# EAGLE schematic MCAT-CANYVAL-TOP-55X (EAGLE 7.2.0)
REV: 000
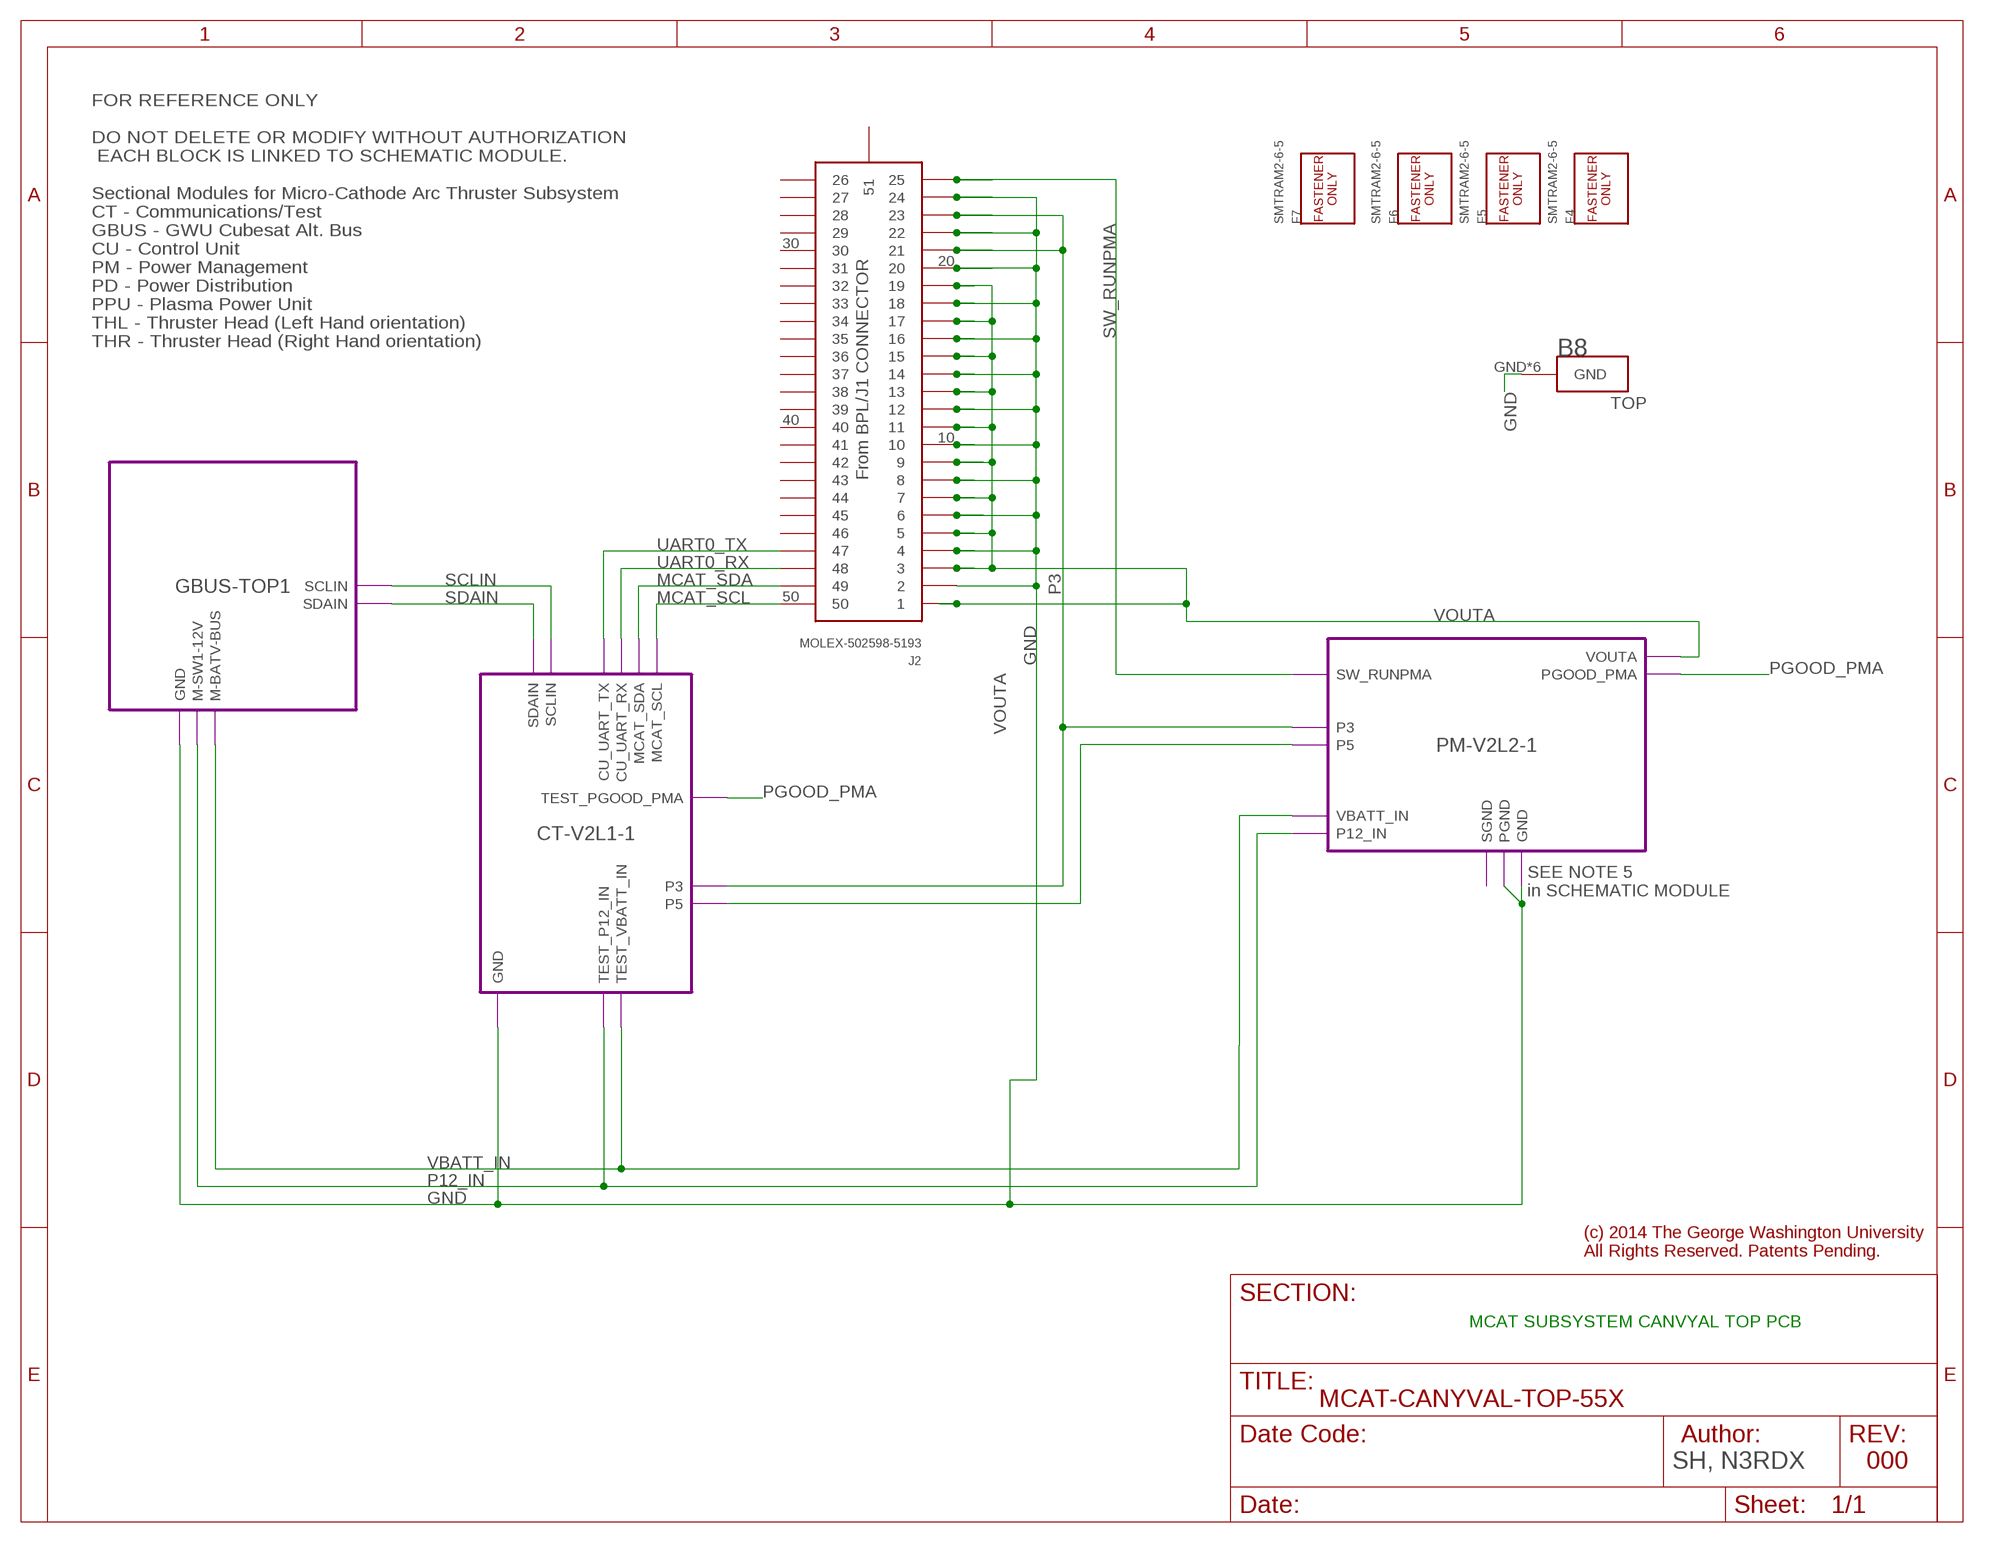
[diagram p0: schematic, sheet 1]

## Parts
B8  MCAT-4CU-C-PCB/TOP  [MCAT-4CU-C-TOP-V4-BLANK]
F4  SMTRAM2-6-5  [SMTRA-M2-6-5]
F5  SMTRAM2-6-5  [SMTRA-M2-6-5]
F6  SMTRAM2-6-5  [SMTRA-M2-6-5]
F7  SMTRAM2-6-5  [SMTRA-M2-6-5]
J2  MOLEX-502598-5193  [MOLEX-502598-5193]

## Module instances
CT-V2L1-1 = CT-V2L1
PM-V2L2-1 = PM-V2L2
GBUS-TOP1 = GBUS-TOP

## Nets
GND: B8.GND B8.GND@1(GND) B8.GND@2(GND) B8.GND@3(GND) B8.GND@4(GND) B8.GND@6(GND) J2.2 J2.4 J2.6 J2.8 J2.10 J2.12 J2.14 J2.16 J2.18 J2.20 J2.22 J2.24 ; port GBUS-TOP1.GND CT-V2L1-1.GND PM-V2L2-1.GND PM-V2L2-1.PGND
MCAT_SCL [General-1mil-100mA]: J2.50 ; port CT-V2L1-1.MCAT_SCL
MCAT_SDA [General-1mil-100mA]: J2.49 ; port CT-V2L1-1.MCAT_SDA
P3 [0.3A-2OZ]: J2.21 J2.23 ; port PM-V2L2-1.P3 CT-V2L1-1.P3
P5: port PM-V2L2-1.P5 CT-V2L1-1.P5
P12_IN [2A-2OZ]: port GBUS-TOP1.M-SW1-12V PM-V2L2-1.P12_IN CT-V2L1-1.TEST_P12_IN
PGOOD_PMA: port PM-V2L2-1.PGOOD_PMA CT-V2L1-1.TEST_PGOOD_PMA
SCLIN: port GBUS-TOP1.SCLIN CT-V2L1-1.SCLIN
SDAIN: port GBUS-TOP1.SDAIN CT-V2L1-1.SDAIN
SW_RUNPMA: J2.25 ; port PM-V2L2-1.SW_RUNPMA
UART0_RX: J2.48 ; port CT-V2L1-1.CU_UART_RX
UART0_TX: J2.47 ; port CT-V2L1-1.CU_UART_TX
VBATT_IN: port PM-V2L2-1.VBATT_IN GBUS-TOP1.M-BATV-BUS CT-V2L1-1.TEST_VBATT_IN
VOUTA [2A-2OZ]: J2.1 J2.3 J2.5 J2.7 J2.9 J2.11 J2.13 J2.15 J2.17 J2.19 ; port PM-V2L2-1.VOUTA
Unconnected: J2.26 J2.27 J2.28 J2.29 J2.30 J2.31 J2.32 J2.33 J2.34 J2.35 J2.36 J2.37 J2.38 J2.39 J2.40 J2.41 J2.42 J2.43 J2.44 J2.45 J2.46 J2.51

## Notes on the sheet
- FOR REFERENCE ONLY
  
  DO NOT DELETE OR MODIFY WITHOUT AUTHORIZATION
   EACH BLOCK IS LINKED TO SCHEMATIC MODULE.
  
  Sectional Modules for Micro-Cathode Arc Thruster Subsystem
  CT - Communications/Test
  GBUS - GWU Cubesat Alt. Bus
  CU - Control Unit
  PM - Power Management
  PD - Power Distribution
  PPU - Plasma Power Unit
  THL - Thruster Head (Left Hand orientation)
  THR - Thruster Head (Right Hand orientation)
- From BPL/J1 CONNECTOR
- SEE NOTE 5 
  in SCHEMATIC MODULE
- MCAT SUBSYSTEM CANVYAL TOP PCB
- SH, N3RDX

## Library data of the parts
B8 = gwu_mpnl_ucat_v10:MCAT-4CU-C-PCB; COPYRIGHT: (c) 2015, The George Washington University. All Rights Reserved; PCBLABEL: TOP
F4-F7 = gwu_mpnl_ucat_v10:SMTRA: Type SMTRA - ReelFast Surface Mount Right Angle (R'ANGLE) Fastener (Metric); MF: Penn Engineering; MPN: SMTRAM2-6-5-DT
J2 = gwu_mpnl_ucat_v10:MOLEX-502598-5193: MOLEX 0.3MM PITCH FPC CONN MALE 51 CKTS MOLEX 502598-5193 based upon SD-502598-003 (2012/08/01); MF: MOLEX; MPN: 502598-5193

## Module GBUS-TOP
Ports: SCLIN(io) SDAIN(io) M-SW1-12V(io) M-BATV-BUS(io) GND(io)
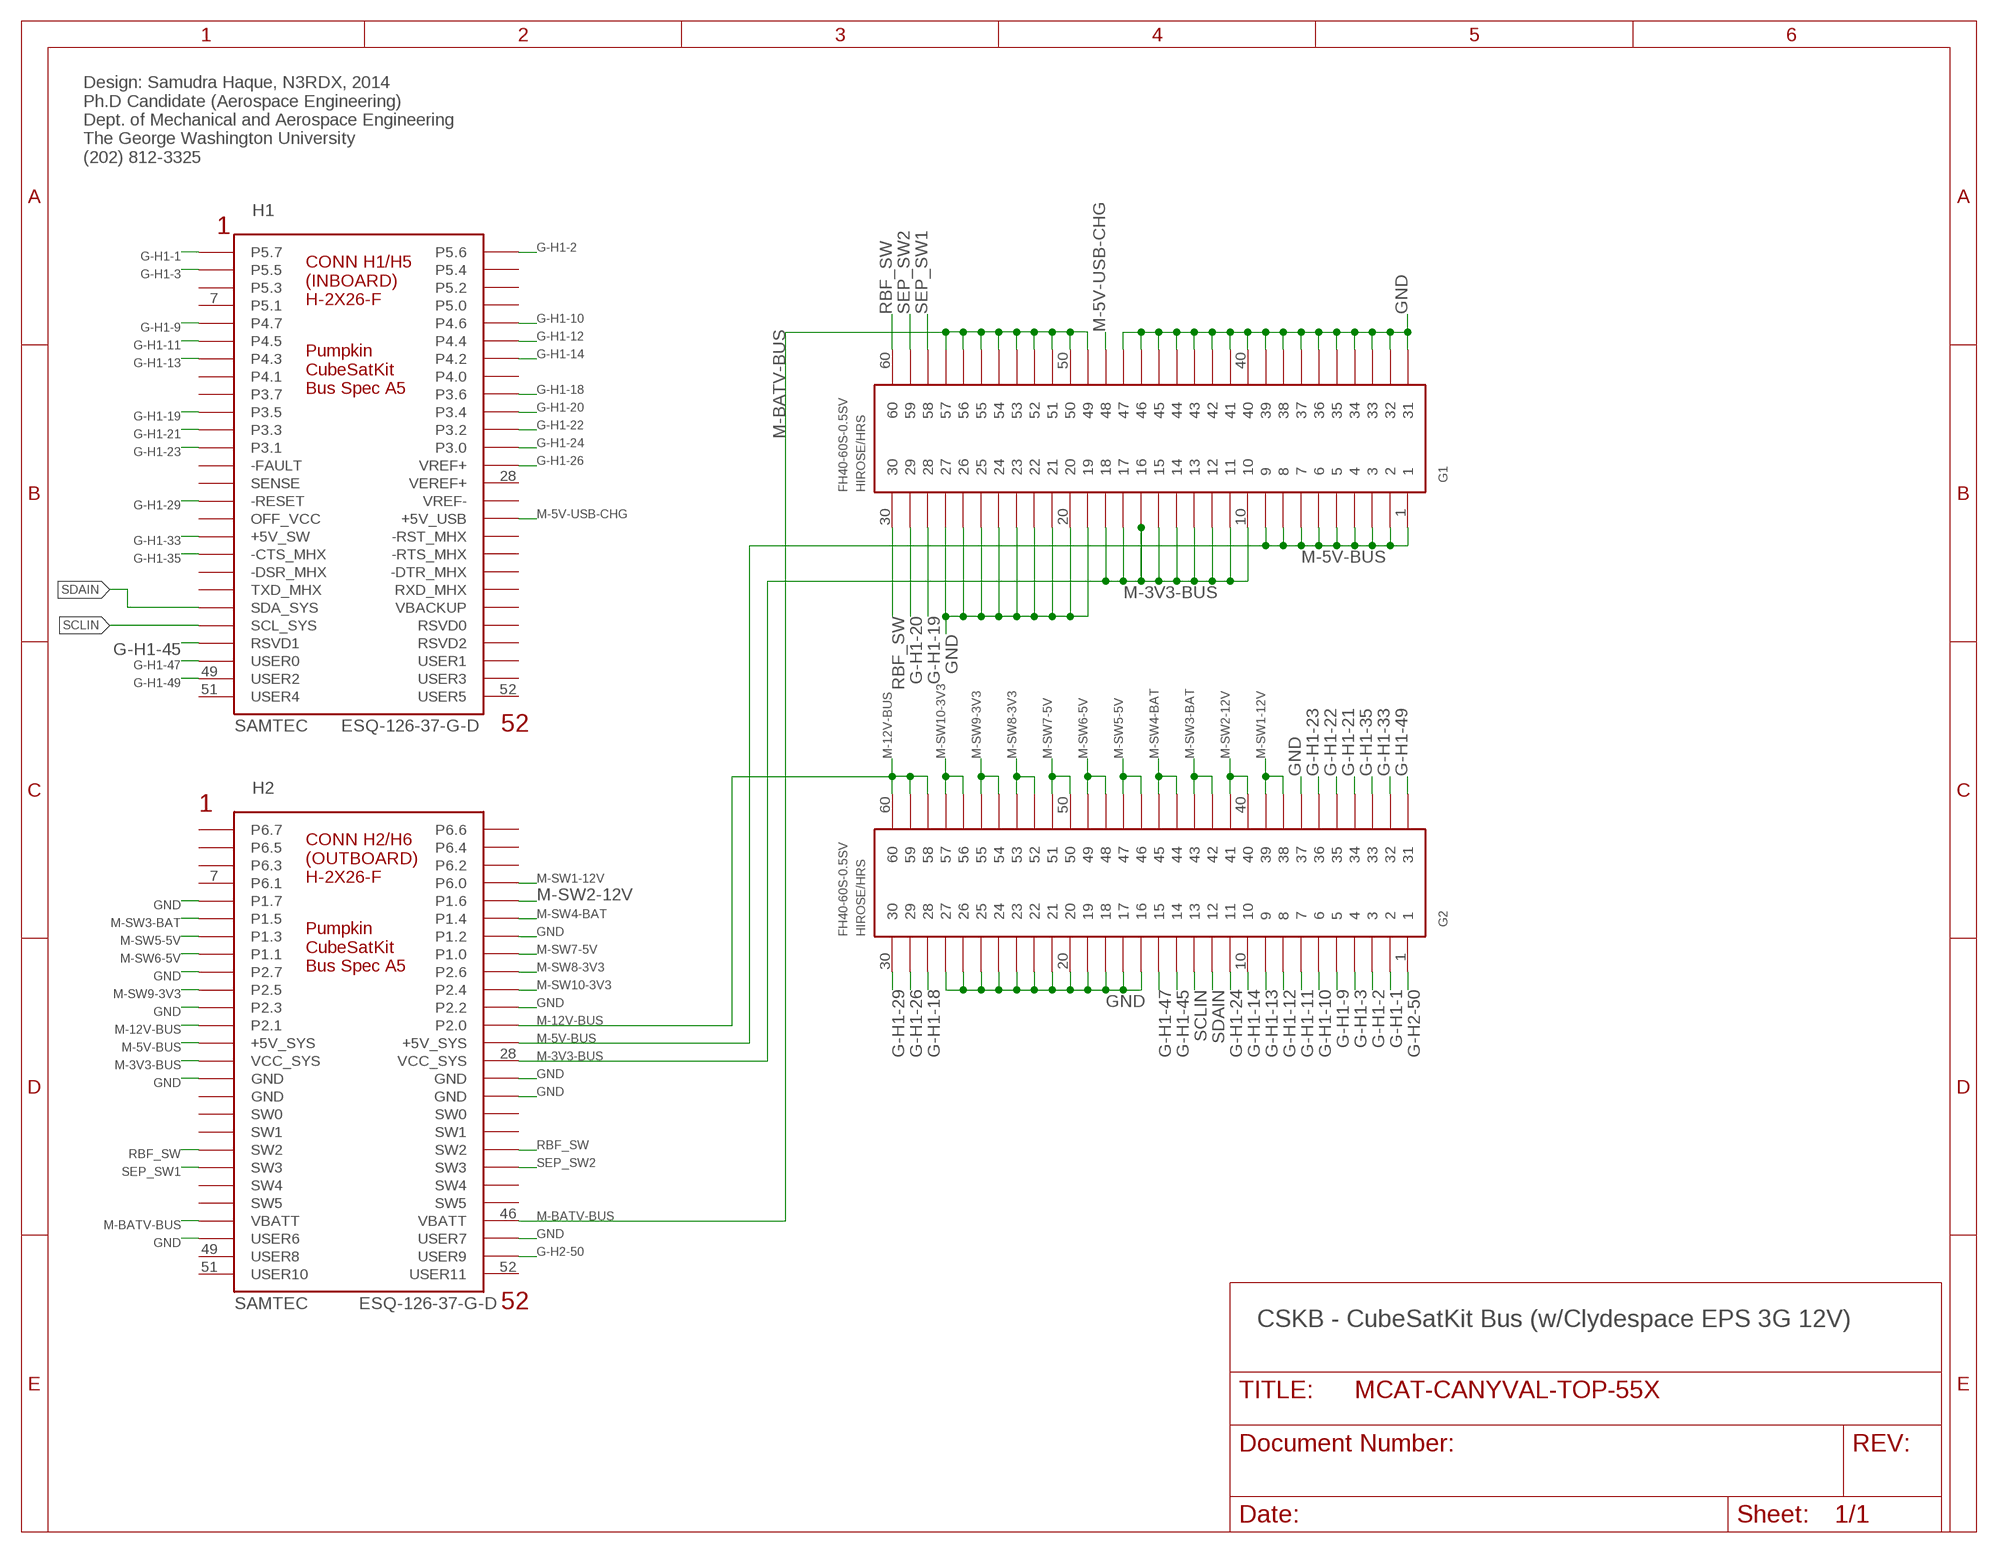
[diagram p1: schematic, module GBUS-TOP, sheet 1]

### Parts
G1  HIROSE-FH40-60S-0.5SV  [HIROSE-FH40-60S-0.5SV]
G2  HIROSE-FH40-60S-0.5SV  [HIROSE-FH40-60S-0.5SV]
H1  H1-H5-INBOARD-CSK-BUS-CONN  [CONN-2X26X0.1-HDR]
H2  H2-H6-OUTBOARD-CSK-BUS-CONN  [CONN-2X26X0.1-HDR]

### Nets
G-H1-1: G2.2 H1.1(P5.7)
G-H1-2: G2.3 H1.2(P5.6)
G-H1-3: G2.4 H1.3(P5.5)
G-H1-9: G2.5 H1.9(P4.7)
G-H1-10: G2.6 H1.10(P4.6)
G-H1-11: G2.7 H1.11(P4.5)
G-H1-12: G2.8 H1.12(P4.4)
G-H1-13: G2.9 H1.13(P4.3)
G-H1-14: G2.10 H1.14(P4.2)
G-H1-18: G2.28 H1.18(P3.6)
G-H1-19: G1.28 H1.19(P3.5)
G-H1-20: G1.29 H1.20(P3.4)
G-H1-21: G2.34 H1.21(P3.3)
G-H1-22: G2.35 H1.22(P3.2)
G-H1-23: G2.36 H1.23(P3.1)
G-H1-24: G2.11 H1.24(P3.0)
G-H1-26: G2.29 H1.26(VREF+)
G-H1-29 [General-1mil-100mA]: G2.30 H1.29(-RESET)
G-H1-33: G2.32 H1.33(+5V_SW)
G-H1-35: G2.33 H1.35(-CTS_MHX)
G-H1-45: G2.14 H1.45(RSVD1)
G-H1-47: G2.15 H1.47(USER0)
G-H1-49: G2.31 H1.49(USER2)
G-H2-50: G2.1 H2.50(USER9)
GND: G1.19 G1.20 G1.21 G1.22 G1.23 G1.24 G1.25 G1.26 G1.27 G1.31 G1.32 G1.33 G1.34 G1.35 G1.36 G1.37 G1.38 G1.39 G1.40 G1.41 G1.42 G1.43 G1.44 G1.45 G1.46 G1.47 G2.16 G2.17 G2.18 G2.19 G2.20 G2.21 G2.22 G2.23 G2.24 G2.25 G2.26 G2.27 G2.37 H2.9(P1.7) H2.14(P1.2) H2.17(P2.7) H2.21(P2.3) H2.22(P2.2) H2.29(GND) H2.30(GND) H2.32(GND) H2.47(USER6) H2.48(USER7)
M-3V3-BUS: G1.10 G1.11 G1.12 G1.13 G1.14 G1.15 G1.16 G1.17 G1.18 H2.27(VCC_SYS) H2.28(VCC_SYS)
M-5V-BUS: G1.1 G1.2 G1.3 G1.4 G1.5 G1.6 G1.7 G1.8 G1.9 H2.25(+5V_SYS) H2.26(+5V_SYS)
M-5V-USB-CHG: G1.48 H1.32(+5V_USB)
M-12V-BUS: G2.58 G2.59 G2.60 H2.23(P2.1) H2.24(P2.0)
M-BATV-BUS: G1.49 G1.50 G1.51 G1.52 G1.53 G1.54 G1.55 G1.56 G1.57 H2.45(VBATT) H2.46(VBATT)
M-SW1-12V [2A-2OZ]: G2.38 G2.39 H2.8(P6.0)
M-SW2-12V: G2.40 G2.41 H2.10(P1.6)
M-SW3-BAT: G2.42 G2.43 H2.11(P1.5)
M-SW4-BAT: G2.44 G2.45 H2.12(P1.4)
M-SW5-5V: G2.46 G2.47 H2.13(P1.3)
M-SW6-5V: G2.48 G2.49 H2.15(P1.1)
M-SW7-5V: G2.50 G2.51 H2.16(P1.0)
M-SW8-3V3: G2.52 G2.53 H2.18(P2.6)
M-SW9-3V3: G2.54 G2.55 H2.19(P2.5)
M-SW10-3V3: G2.56 G2.57 H2.20(P2.4)
RBF_SW: G1.30 G1.60 H2.37(SW2) H2.38(SW2)
SCLIN: G2.13 H1.43(SCL_SYS)
SDAIN: G2.12 H1.41(SDA_SYS)
SEP_SW1: G1.58 H2.39(SW3)
SEP_SW2: G1.59 H2.40(SW3)
Unconnected: H1.4(P5.4) H1.5(P5.3) H1.6(P5.2) H1.7(P5.1) H1.8(P5.0) H1.15(P4.1) H1.16(P4.0) H1.17(P3.7) H1.25(-FAULT) H1.27(SENSE) H1.28(VEREF+) H1.30(VREF-) H1.31(OFF_VCC) H1.34(-RST_MHX) H1.36(-RTS_MHX) H1.37(-DSR_MHX) H1.38(-DTR_MHX) H1.39(TXD_MHX) H1.40(RXD_MHX) H1.42(VBACKUP) H1.44(RSVD0) H1.46(RSVD2) H1.48(USER1) H1.50(USER3) H1.51(USER4) H1.52(USER5) H2.1(P6.7) H2.2(P6.6) H2.3(P6.5) H2.4(P6.4) H2.5(P6.3) H2.6(P6.2) H2.7(P6.1) H2.31(GND) H2.33(SW0) H2.34(SW0) H2.35(SW1) H2.36(SW1) H2.41(SW4) H2.42(SW4) H2.43(SW5) H2.44(SW5) H2.49(USER8) H2.51(USER10) H2.52(USER11)

### Notes on the sheet
- Design: Samudra Haque, N3RDX, 2014
  Ph.D Candidate (Aerospace Engineering)
  Dept. of Mechanical and Aerospace Engineering
  The George Washington University
  (202) 812-3325
- CSKB - CubeSatKit Bus (w/Clydespace EPS 3G 12V)

### Library data of the parts
G1 = gwu_mpnl_ucat_v10:HIROSE-FH40-60S-0.5SV; MF: HIROSE/HRS; MPN: FH40-60S-0.5SV; PCBLABEL: G1
G2 = gwu_mpnl_ucat_v10:HIROSE-FH40-60S-0.5SV; MF: HIROSE/HRS; MPN: FH40-60S-0.5SV; PCBLABEL: G2
H1 = gwu_mpnl_ucat_v10:H1-H5-INBOARD-CSK-BUS-CONN: H1/H5/Inboard Cubesat Kit Bus Connector 1 x Samtec ESQ-126-39-G-D Connectors 104 pins per Cubesat Kit Bus Spec A5 Place H1/H5 (Inboard) conn. pin #1 at 3.275"x0.550" exactly. Pins 1-52; MF: SAMTEC; MPN: ESQ-126-37-G-D; PCBLABEL: H1
H2 = gwu_mpnl_ucat_v10:H2-H6-OUTBOARD-CSK-BUS-CONN; MF: SAMTEC; MPN: ESQ-126-37-G-D; PCBLABEL: H2

## Module CT-V2L1
Ports: GND(io) SCLIN(io) SDAIN(io) P3(io) P5(io) CU_UART_RX(io) CU_UART_TX(io) TEST_P12_IN(io) TEST_VBATT_IN(io) TEST_PGOOD_PMA(io) MCAT_SDA(io) MCAT_SCL(io)
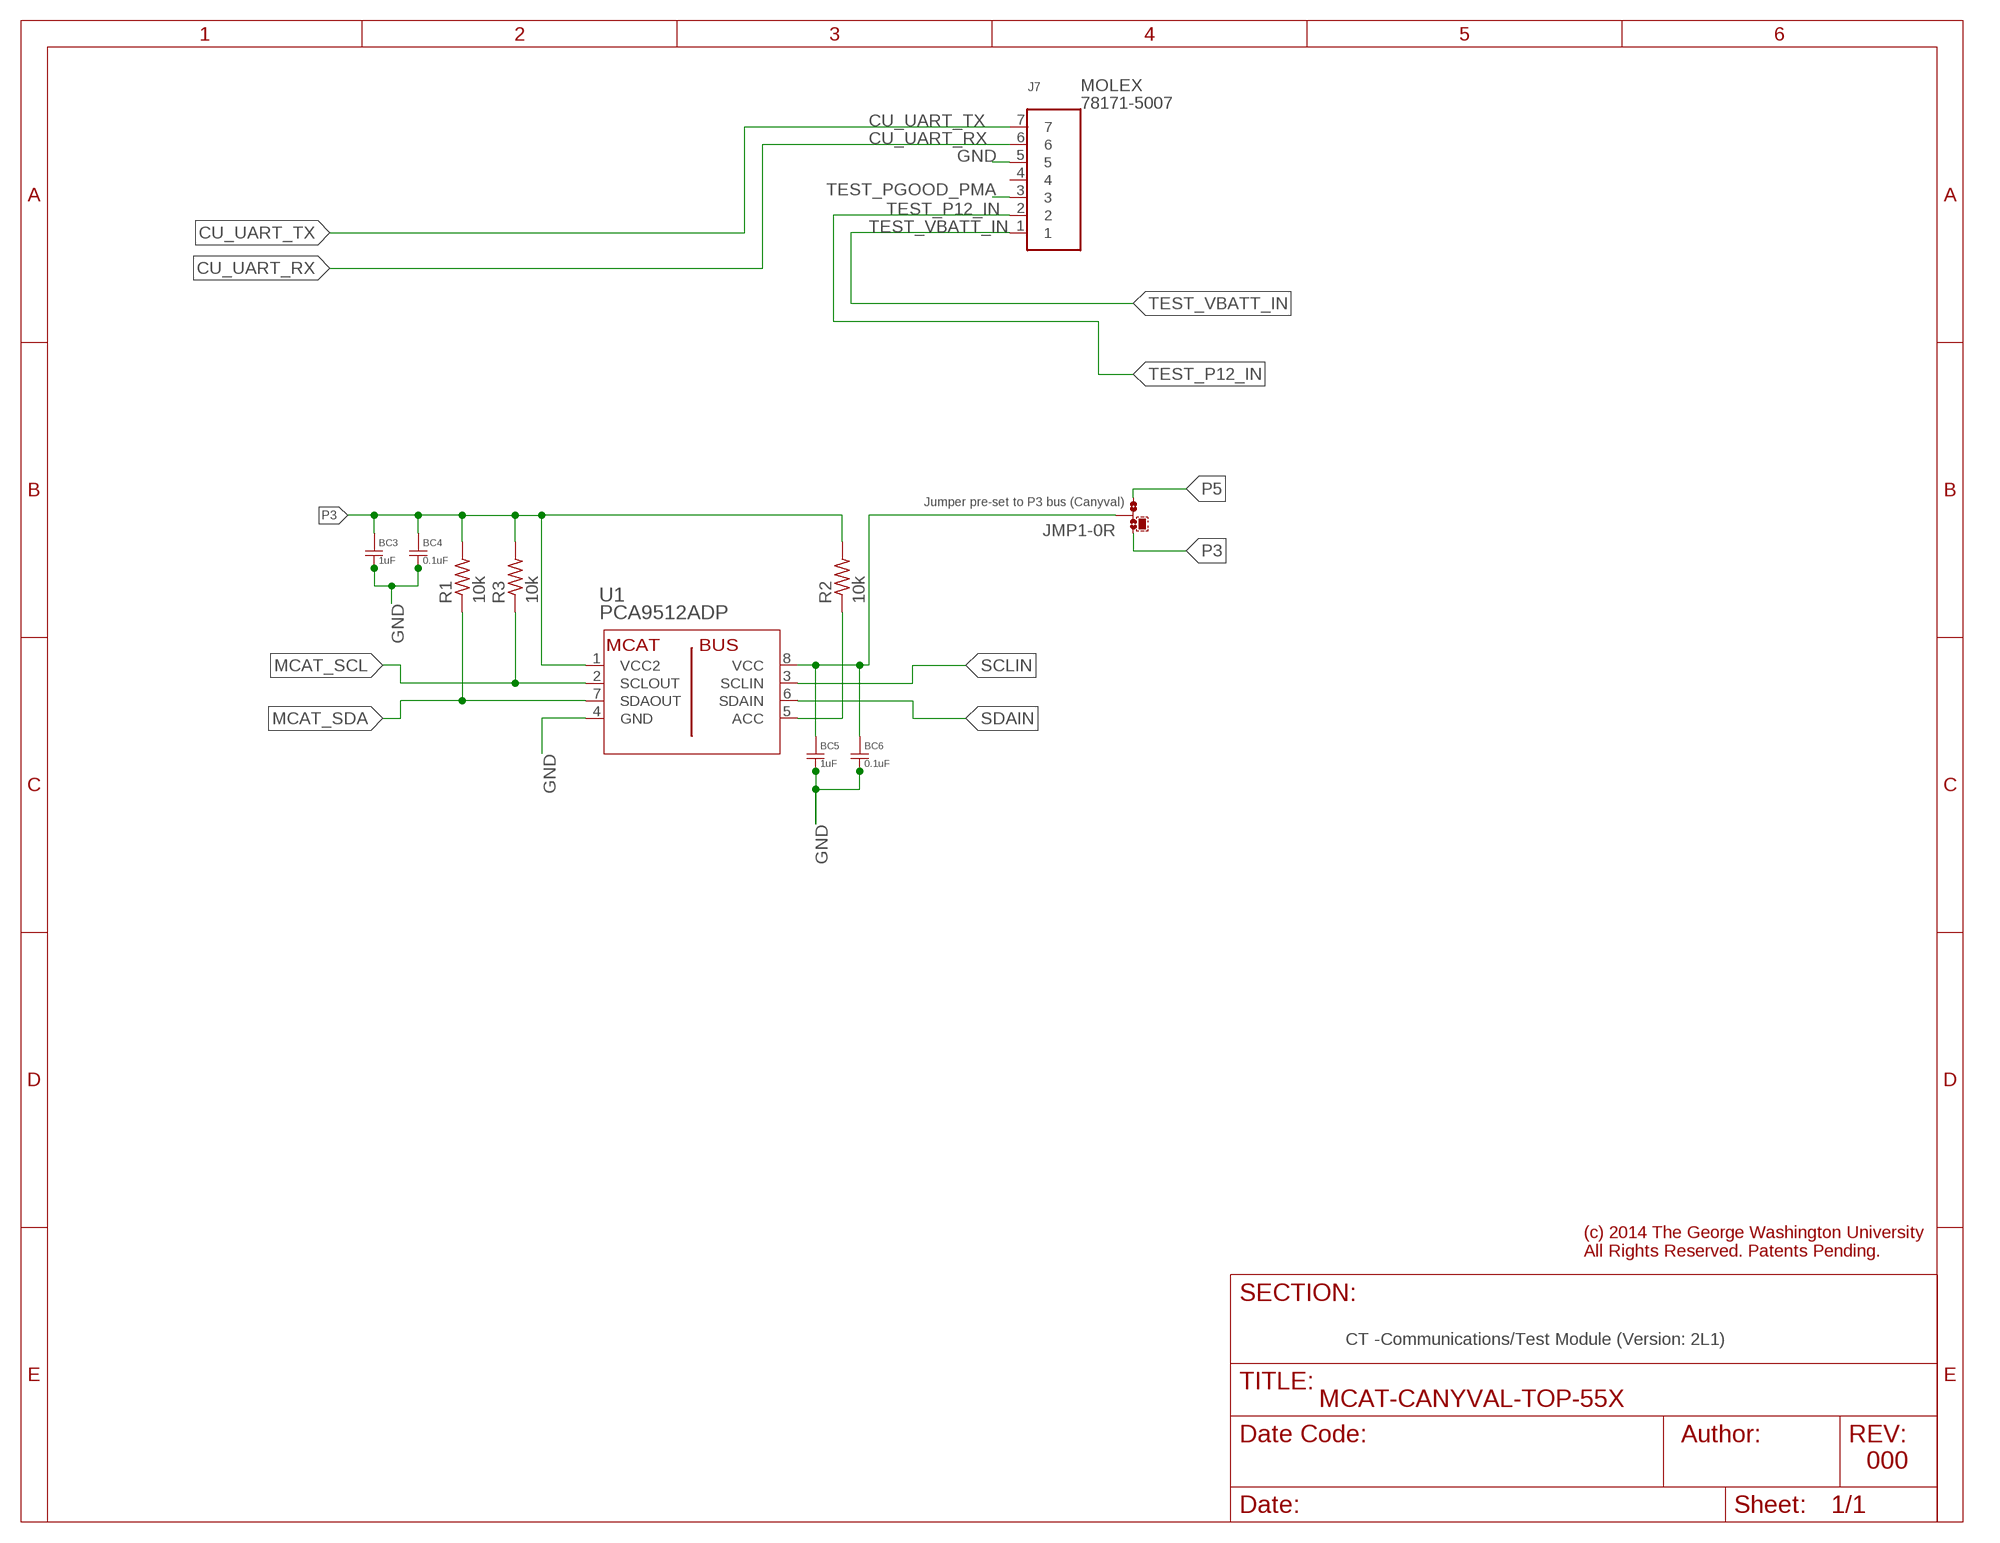
[diagram p2: schematic, module CT-V2L1, sheet 1]

### Parts
BC3  BYPASS-CAP-1UF  [0612-REV]
BC4  BYPASS-CAP-0.1UF  [0612-REV]
BC5  BYPASS-CAP-1UF  [0612-REV]
BC6  BYPASS-CAP-0.1UF  [0612-REV]
J7  MOLEX-78171-5007  [MOLEX-78171-5007]
JMP1  0R-JUMPA  [A0R-JMP]
R1  10k  R-US_R0402  [R0402]
R2  10k  R-US_R0402  [R0402]
R3  10k  R-US_R0402  [R0402]
U1  PCA9512ADP  [SOT505-1]

### Nets
CU_UART_RX: J7.6
CU_UART_TX: J7.7
GND: BC3.2 BC4.2 BC5.2 BC6.2 J7.5 U1.4(GND)
I2C_VCC: BC5.1 BC6.1 JMP1.2 U1.8(VCC)
MCAT_SCL: R3.1 U1.2(SCLOUT)
MCAT_SDA: R1.1 U1.7(SDAOUT)
N$2: R2.1 U1.5(ACC)
P3: BC3.1 BC4.1 JMP1.1 R1.2 R2.2 R3.2 U1.1(VCC2)
P5: JMP1.3
SCLIN: U1.3(SCLIN)
SDAIN: U1.6(SDAIN)
TEST_P12_IN: J7.2
TEST_PGOOD_PMA: J7.3
TEST_VBATT_IN: J7.1
Unconnected: J7.4

### Notes on the sheet
- Jumper pre-set to P3 bus (Canyval)
- CT -Communications/Test Module (Version: 2L1)

### Library data of the parts
BC3 BC5 = gwu_mpnl_ucat_v10:BYPASS-CAP-1UF; MF: AVX; MPN: 0612YC105KAT2A
BC4 BC6 = gwu_mpnl_ucat_v10:BYPASS-CAP-0.1UF; MF: AVX; MPN: 06123C104KAT2A
J7 = gwu_mpnl_ucat_v10:MOLEX-78171-5007; MF: MOLEX; MPN: 78171-5007
JMP1 = jump-0r-smd:0R-JUMP: SMD 0R 0805 Jumper; MF: Vishay/Dale; MPN: CRCW08050000Z0EA
R1-R3 = resistor:R-US_: RESISTOR, American symbol; MF: PANASONIC; MPN: ERA-2AEB103X
U1 = gwu_mpnl_ucat_v10:PCA9512ADP; MANUFACTURER_PART_NUMBER: PCA9512ADP; VENDOR: NXP

## Module PM-V2L2
Ports: SW_RUNPMA(io) PGOOD_PMA(out) SGND(io) GND(io) VOUTA(out) PGND(io) P3(io) P5(io) VBATT_IN(io) P12_IN(io)
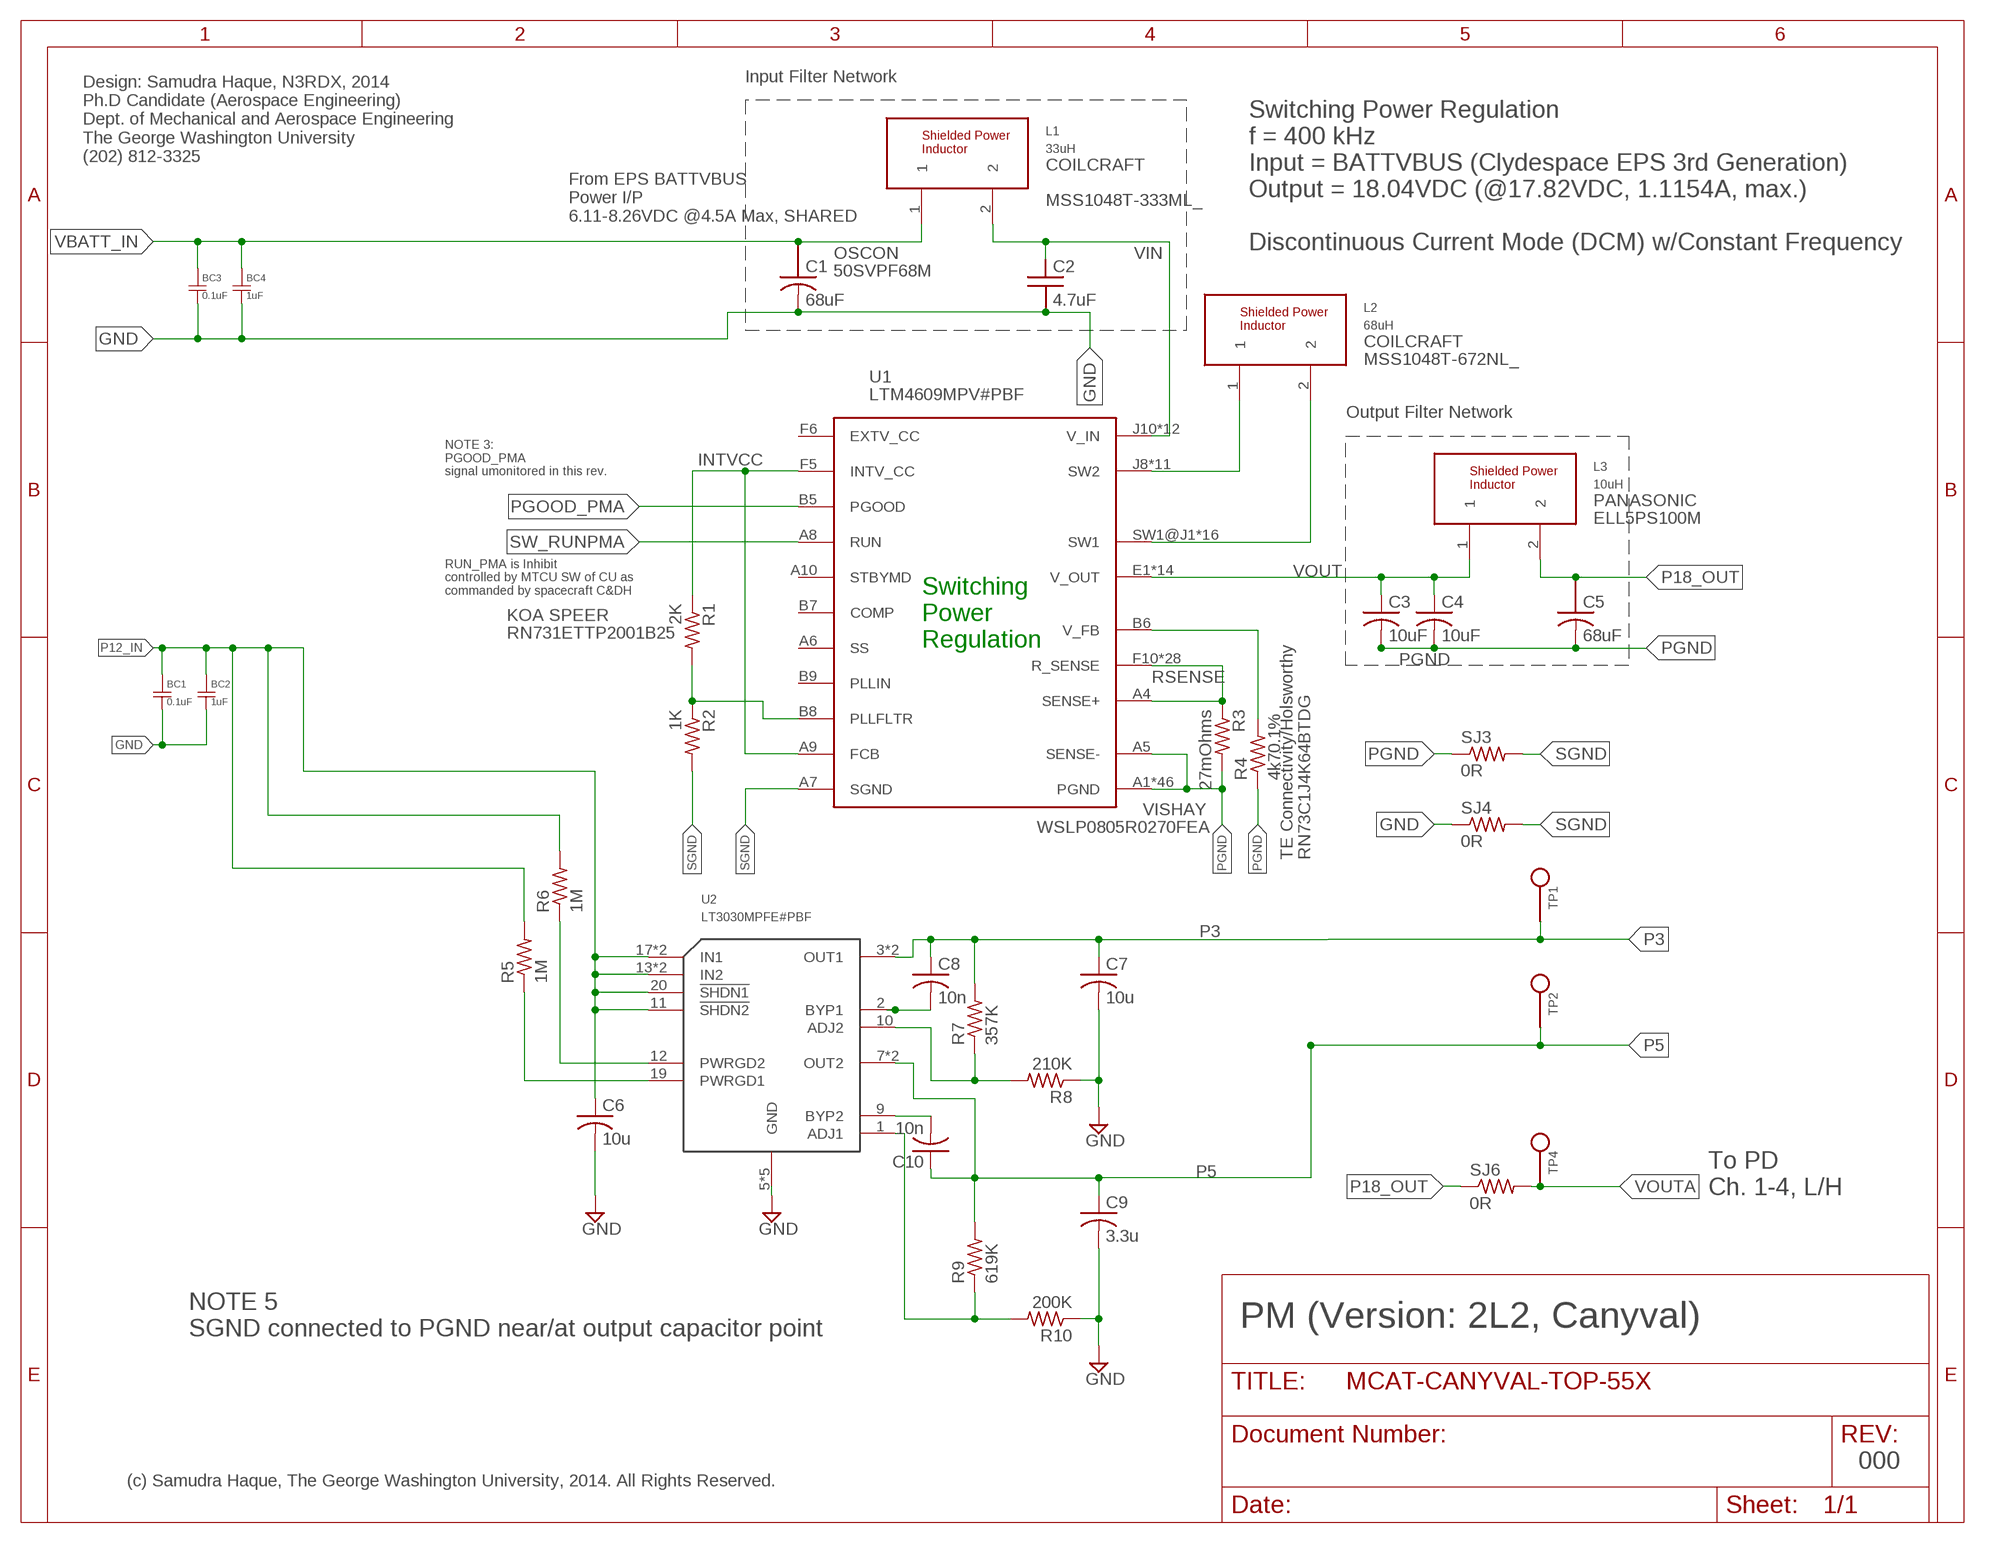
[diagram p3: schematic, module PM-V2L2, sheet 1]

### Parts
BC1  BYPASS-CAP-0.1UF  [0612-REV]
BC2  BYPASS-CAP-1UF  [0612-REV]
BC3  BYPASS-CAP-0.1UF  [0612-REV]
BC4  BYPASS-CAP-1UF  [0612-REV]
C1  68uF  OSCON-50SVPF68M  [OS-CON-SVPF-F12]
C2  4.7uF  AVX-LD105C475KAB2A  [MLCC-X7R-1210]
C3  10uF  C-USC1210K  [C1210K]
C4  10uF  C-USC1210K  [C1210K]
C5  68uF  OSCON-50SVPF68M  [OS-CON-SVPF-F12]
C6  10u  C-USC1210  [C1210]
C7  10u  C-USC1206  [C1206]
C8  10n  C-USC0402  [C0402]
C9  3.3u  C-USC0805  [C0805]
C10  10n  C-USC0402  [C0402]
L1  33uH  MSS1048  [MSS1048]
L2  68uH  MSS1048  [MSS1048]
L3  10uH  ELL-5PS100M  [SERIES-POWER-INDUCTORS]
R1  2K  R-US_R0402  [R0402]
R2  1K  R-US_R0402  [R0402]
R3  27mOhms  R-US_R0805  [R0805]
R4  4k70.1%  R-US_R0603  [R0603]
R5  1M  R-US_R0402  [R0402]
R6  1M  R-US_R0402  [R0402]
R7  357K  R-US_R1206  [R1206]
R8  210K  R-US_R0402  [R0402]
R9  619K  R-US_R0805  [R0805]
R10  200K  R-US_R0402  [R0402]
SJ3  0R  R-US_R0805  [R0805]
SJ4  0R  R-US_R0805  [R0805]
SJ6  0R  R-US_R0805  [R0805]
TP1  PCB-MINI-SMD-TESTPOINT/SQ  [PCB-MINI-SMD-TESTPOINT]
TP2  PCB-MINI-SMD-TESTPOINT/SQ  [PCB-MINI-SMD-TESTPOINT]
TP4  PCB-MINI-SMD-TESTPOINT/SQ  [PCB-MINI-SMD-TESTPOINT]
U1  LTM4609MPV#PBF  LTM4609MPV#PBFROHS/HITEMP  [LGA-141-LTC-05-08-1840-B]
U2  LT3030MPFE#PBF  [TSSOP20-FE-CB]

### Nets
ADJ1: R9.1 R10.2 U2.1(ADJ1)
ADJ2: R7.1 R8.2 U2.10(ADJ2)
BYP1: C8.2 U2.2(BYP1)
BYP2: C10.2 U2.9(BYP2)
GND: BC1.2 BC2.2 BC3.2 BC4.2 C1.K1(K) C2.2 C6.2 C7.2 C9.2 R8.1 R10.1 SJ4.1 U2.5(GND) U2.6(GND) U2.15(GND) U2.16(GND) U2.21(GND)
INTVCC: R1.1 U1.A9(FCB) U1.F5(INTV_CC)
P3: C7.1 C8.1 R7.2 TP1.1(TP) U2.3(OUT1) U2.4(OUT1)
P5: C9.1 C10.1 R9.2 TP2.1(TP) U2.7(OUT2) U2.8(OUT2)
P12_IN [2A-2OZ]: BC1.1 BC2.1 C6.1 R5.2 R6.2 U2.11(!SHDN2) U2.13(IN2) U2.14(IN2) U2.17(IN1) U2.18(IN1) U2.20(!SHDN1)
P18_OUT [1A-2OZ]: C5.A1(A) L3.2 SJ6.1
PGND: C3.2 C4.2 C5.K1(K) R3.2 R4.1 SJ3.1 U1.A1(PGND) U1.A2(PGND) U1.A3(PGND) U1.A5(SENSE-) U1.A11(PGND) U1.A12(PGND) U1.B1(PGND) U1.B2(PGND) U1.B3(PGND) U1.B4(PGND) U1.B10(PGND) U1.B11(PGND) U1.B12(PGND) U1.C1(PGND) U1.C2(PGND) U1.C3(PGND) U1.C4(PGND) U1.C5(PGND) U1.C6(PGND) U1.C7(PGND) U1.C8(PGND) U1.C9(PGND) U1.C10(PGND) U1.C11(PGND) U1.C12(PGND) U1.D1(PGND) U1.D2(PGND) U1.D3(PGND) U1.D4(PGND) U1.D5(PGND) U1.D6(PGND) U1.D7(PGND) U1.D8(PGND) U1.D9(PGND) U1.D10(PGND) U1.D11(PGND) U1.D12(PGND) U1.E3(PGND) U1.E4(PGND) U1.E5(PGND) U1.E6(PGND) U1.E7(PGND) U1.E8(PGND) U1.E9(PGND) U1.E10(PGND) U1.E11(PGND) U1.E12(PGND)
PGOOD_PMA: U1.B5(PGOOD)
PWRDGD2: R6.1 U2.12(PWRGD2)
PWRGD1: R5.1 U2.19(PWRGD1)
RSENSE: R3.1 U1.A4(SENSE+) U1.F10(R_SENSE) U1.F11(R_SENSE) U1.F12(R_SENSE) U1.G5(R_SENSE) U1.G6(R_SENSE) U1.G7(R_SENSE) U1.G8(R_SENSE) U1.G9(R_SENSE) U1.G10(R_SENSE) U1.G11(R_SENSE) U1.G12(R_SENSE) U1.H5(R_SENSE) U1.H6(R_SENSE) U1.H7(R_SENSE) U1.H8(R_SENSE) U1.H9(R_SENSE) U1.H10(R_SENSE) U1.H11(R_SENSE) U1.H12(R_SENSE) U1.J5(R_SENSE) U1.J6(R_SENSE) U1.J7(R_SENSE) U1.K5(R_SENSE) U1.K6(R_SENSE) U1.L5(R_SENSE) U1.L6(R_SENSE) U1.M5(R_SENSE) U1.M6(R_SENSE)
SETFREQ: R1.2 R2.1 U1.B8(PLLFLTR)
SGND: R2.2 SJ3.2 SJ4.2 U1.A7(SGND)
SW1: L2.2 U1.SW1@J1(SW1) U1.SW1@J2(SW1) U1.SW1@J3(SW1) U1.SW1@J4(SW1) U1.SW1@K1(SW1) U1.SW1@K2(SW1) U1.SW1@K3(SW1) U1.SW1@K4(SW1) U1.SW1@L1(SW1) U1.SW1@L2(SW1) U1.SW1@L3(SW1) U1.SW1@L4(SW1) U1.SW1@M1(SW1) U1.SW1@M2(SW1) U1.SW1@M3(SW1) U1.SW1@M4(SW1)
SW2: L2.1 U1.J8(SW2) U1.J9(SW2) U1.K7(SW2) U1.K8(SW2) U1.K9(SW2) U1.L7(SW2) U1.L8(SW2) U1.L9(SW2) U1.M7(SW2) U1.M8(SW2) U1.M9(SW2)
SW_RUNPMA: U1.A8(RUN)
VBATT_IN [2A-2OZ]: BC3.1 BC4.1 C1.A1(A) L1.1
VFB: R4.2 U1.B6(V_FB)
VIN [2A-2OZ]: C2.1 L1.2 U1.J10(V_IN) U1.J11(V_IN) U1.J12(V_IN) U1.K10(V_IN) U1.K11(V_IN) U1.K12(V_IN) U1.L10(V_IN) U1.L11(V_IN) U1.L12(V_IN) U1.M10(V_IN) U1.M11(V_IN) U1.M12(V_IN)
VOUT [1A-2OZ]: C3.1 C4.1 L3.1 U1.E1(V_OUT) U1.E2(V_OUT) U1.F1(V_OUT) U1.F2(V_OUT) U1.F3(V_OUT) U1.F4(V_OUT) U1.G1(V_OUT) U1.G2(V_OUT) U1.G3(V_OUT) U1.G4(V_OUT) U1.H2(V_OUT) U1.H3(V_OUT) U1.H4(V_OUT) U1.VOUT(V_OUT)
VOUTA: SJ6.2 TP4.1(TP)
Unconnected: U1.A6(SS) U1.A10(STBYMD) U1.B7(COMP) U1.B9(PLLIN) U1.F6(EXTV_CC)

### Notes on the sheet
- Input Filter Network
- Design: Samudra Haque, N3RDX, 2014
  Ph.D Candidate (Aerospace Engineering)
  Dept. of Mechanical and Aerospace Engineering
  The George Washington University
  (202) 812-3325
- Switching Power Regulation
  f = 400 kHz
  Input = BATTVBUS (Clydespace EPS 3rd Generation)
  Output = 18.04VDC (@17.82VDC, 1.1154A, max.)
  
  Discontinuous Current Mode (DCM) w/Constant Frequency
- From EPS BATTVBUS 
  Power I/P
  6.11-8.26VDC @4.5A Max, SHARED
- Output Filter Network
- NOTE 3:
  PGOOD_PMA
  signal umonitored in this rev.
  
  
  
  
  
  
  RUN_PMA is Inhibit 
  controlled by MTCU SW of CU as
  commanded by spacecraft C&DH
- Switching 
  Power 
  Regulation
- To PD
  Ch. 1-4, L/H
- PM (Version: 2L2, Canyval)
- NOTE 5
  SGND connected to PGND near/at output capacitor point
- (c) Samudra Haque, The George Washington University, 2014. All Rights Reserved.

### Library data of the parts
BC1 BC3 = gwu_mpnl_ucat_v10:BYPASS-CAP-0.1UF; MF: AVX; MPN: 06123C104KAT2A
BC2 BC4 = gwu_mpnl_ucat_v10:BYPASS-CAP-1UF; MF: AVX; MPN: 0612YC105KAT2A
C1 C5 = samudra_ucat_v9:OSCON-50SVPF; MF: OSCON; MPN: 50SVPF68M
C2 = samudra_ucat_v9:AVX-LD105C475KAB2A; MF: AVX; MPN: LD105C475KAB2A
C3 C4 = rcl:C-US: CAPACITOR, American symbol; MF: MURATA; MPN: GRM32ER71H106KA12L
C6 = adafruit:C-US: CAPACITOR, American symbol; MF: AVX; MPN: TCJT106M016R0200
C7 = resistor:C-US: CAPACITOR, American symbol; MF: TDK; MPN: C3216X7R1C106K160AC
C8 C10 = resistor:C-US: CAPACITOR, American symbol; MF: VISHAY/VITRAMON; MPN: VJ0402Y103JXJPW1BC
C9 = resistor:C-US: CAPACITOR, American symbol; MF: TDK; MPN: C2012X7R1C335K125AB
L1 = gwu_mpnl_ucat_v10:MSS1048; MF: COILCRAFT; MPN: MSS1048T-333ML_
L2 = gwu_mpnl_ucat_v10:MSS1048; MF: COILCRAFT; MPN: MSS1048T-672NL_
L3 = gwu_mpnl_ucat_v10:ELL-5PS100M; MF: PANASONIC; MPN: ELL5PS100M; OC_FARNELL: 1717452
R1 = rcl:R-US_: RESISTOR, American symbol; MF: KOA SPEER; MPN: RN731ETTP2001B25
R2 = rcl:R-US_: RESISTOR, American symbol; MF: KOA SPEER; MPN: RN73H1ETTP1001B25
R3 = resistor:R-US_: RESISTOR, American symbol; MF: VISHAY; MPN: WSLP0805R0270FEA
R4 = resistor:R-US_: RESISTOR, American symbol; MF: TE Connectivity/Holsworthy; MPN: RN73C1J4K64BTDG
R5 R6 = rcl:R-US_: RESISTOR, American symbol; MF: VISHAY/BEYSCHLAG; MPN: MCS04020C1004FE000
R7 = rcl:R-US_: RESISTOR, American symbol; MF: IRC / TT Electronics; MPN: PCF-W1206LF-12-3573-B-P-LT
R8 = rcl:R-US_: RESISTOR, American symbol; MF: Vishay / Dale; MPN: CRCW0402210KFKED
R9 = rcl:R-US_: RESISTOR, American symbol; MF: Welwyn Components / TT Electronics; MPN: PCF0805R-619KBT1
R10 = rcl:R-US_: RESISTOR, American symbol; MF: Vishay / Dale; MPN: CRCW0402200KFKED
SJ3 SJ4 SJ6 = resistor:R-US_: RESISTOR, American symbol; MF: YAGEO; MPN: AF0805JR-070RL
TP1 TP2 TP4 = gwu_mpnl_ucat_v10:PCB-MINI-SMD-TESTPOINT; MF: Keystone Electronics; MPN: 5015
U1 = gwu_mpnl_ucat_v10:LTM4609MPV#PBF: Per LTC Datasheet 4609fe LTM4609 (c) Samudra Haque, N3RDX, 2/23/2014; MF: Linear; MPN: LTM4609MPV#PBF
U2 = gwu_mpnl_ucat_v10:LT3030; MF: LINEAR; MPN: LT3030MPFE#TRPBF

## Net classes
0 default: width 0.051 mm
1 1A-2OZ: width 0.152 mm
2 2A-2OZ: width 0.356 mm
3 0.3A-2OZ: width 0.254 mm
4 General-1mil-100mA: width 0.025 mm
5 0.5-2OZ: width 0.051 mm
6 3A-2OZ: width 1.194 mm
7 4.5A-2OZ: width 1.524 mm